# Altium schematic sheet Power.SchDoc: =Board +' X7A15T-PSU-LTTM4644'
size A3; Date: OCT 2018; CheckedBy: ALL; Author: Moerz; CompanyName: TDK-Micronas GmbH; DrawnBy: Moerz; Engineer: Moerz; Address1: Hans-Bunte-Strasse 19; Address2: D-79108 Freiburg; Address3: Germany; SheetNumber: 54; SheetTotal: 80; DateDraw: OCT 2018; DateChecked: N/A; PageSetup: Record=PageOptions|CenterHorizontal=True|CenterVertical=True|PrintScale=0.97|XCorrection=1.00|YCorrection=1.00|PrintKind=0|BorderSize=5000000|LeftOffset=0|BottomOffset=0|Orientation=2|PaperLength=1000|PaperWidth=1000|Scale=100|PaperSource=7|PrintQuality=-3|MediaType=1|DitherType=10|PrintScaleMode=1|PaperKind=A4|PaperIndex=9; TitleTyp: Title-Typ; Block: CPU & SCT8; Workspace: Workspace
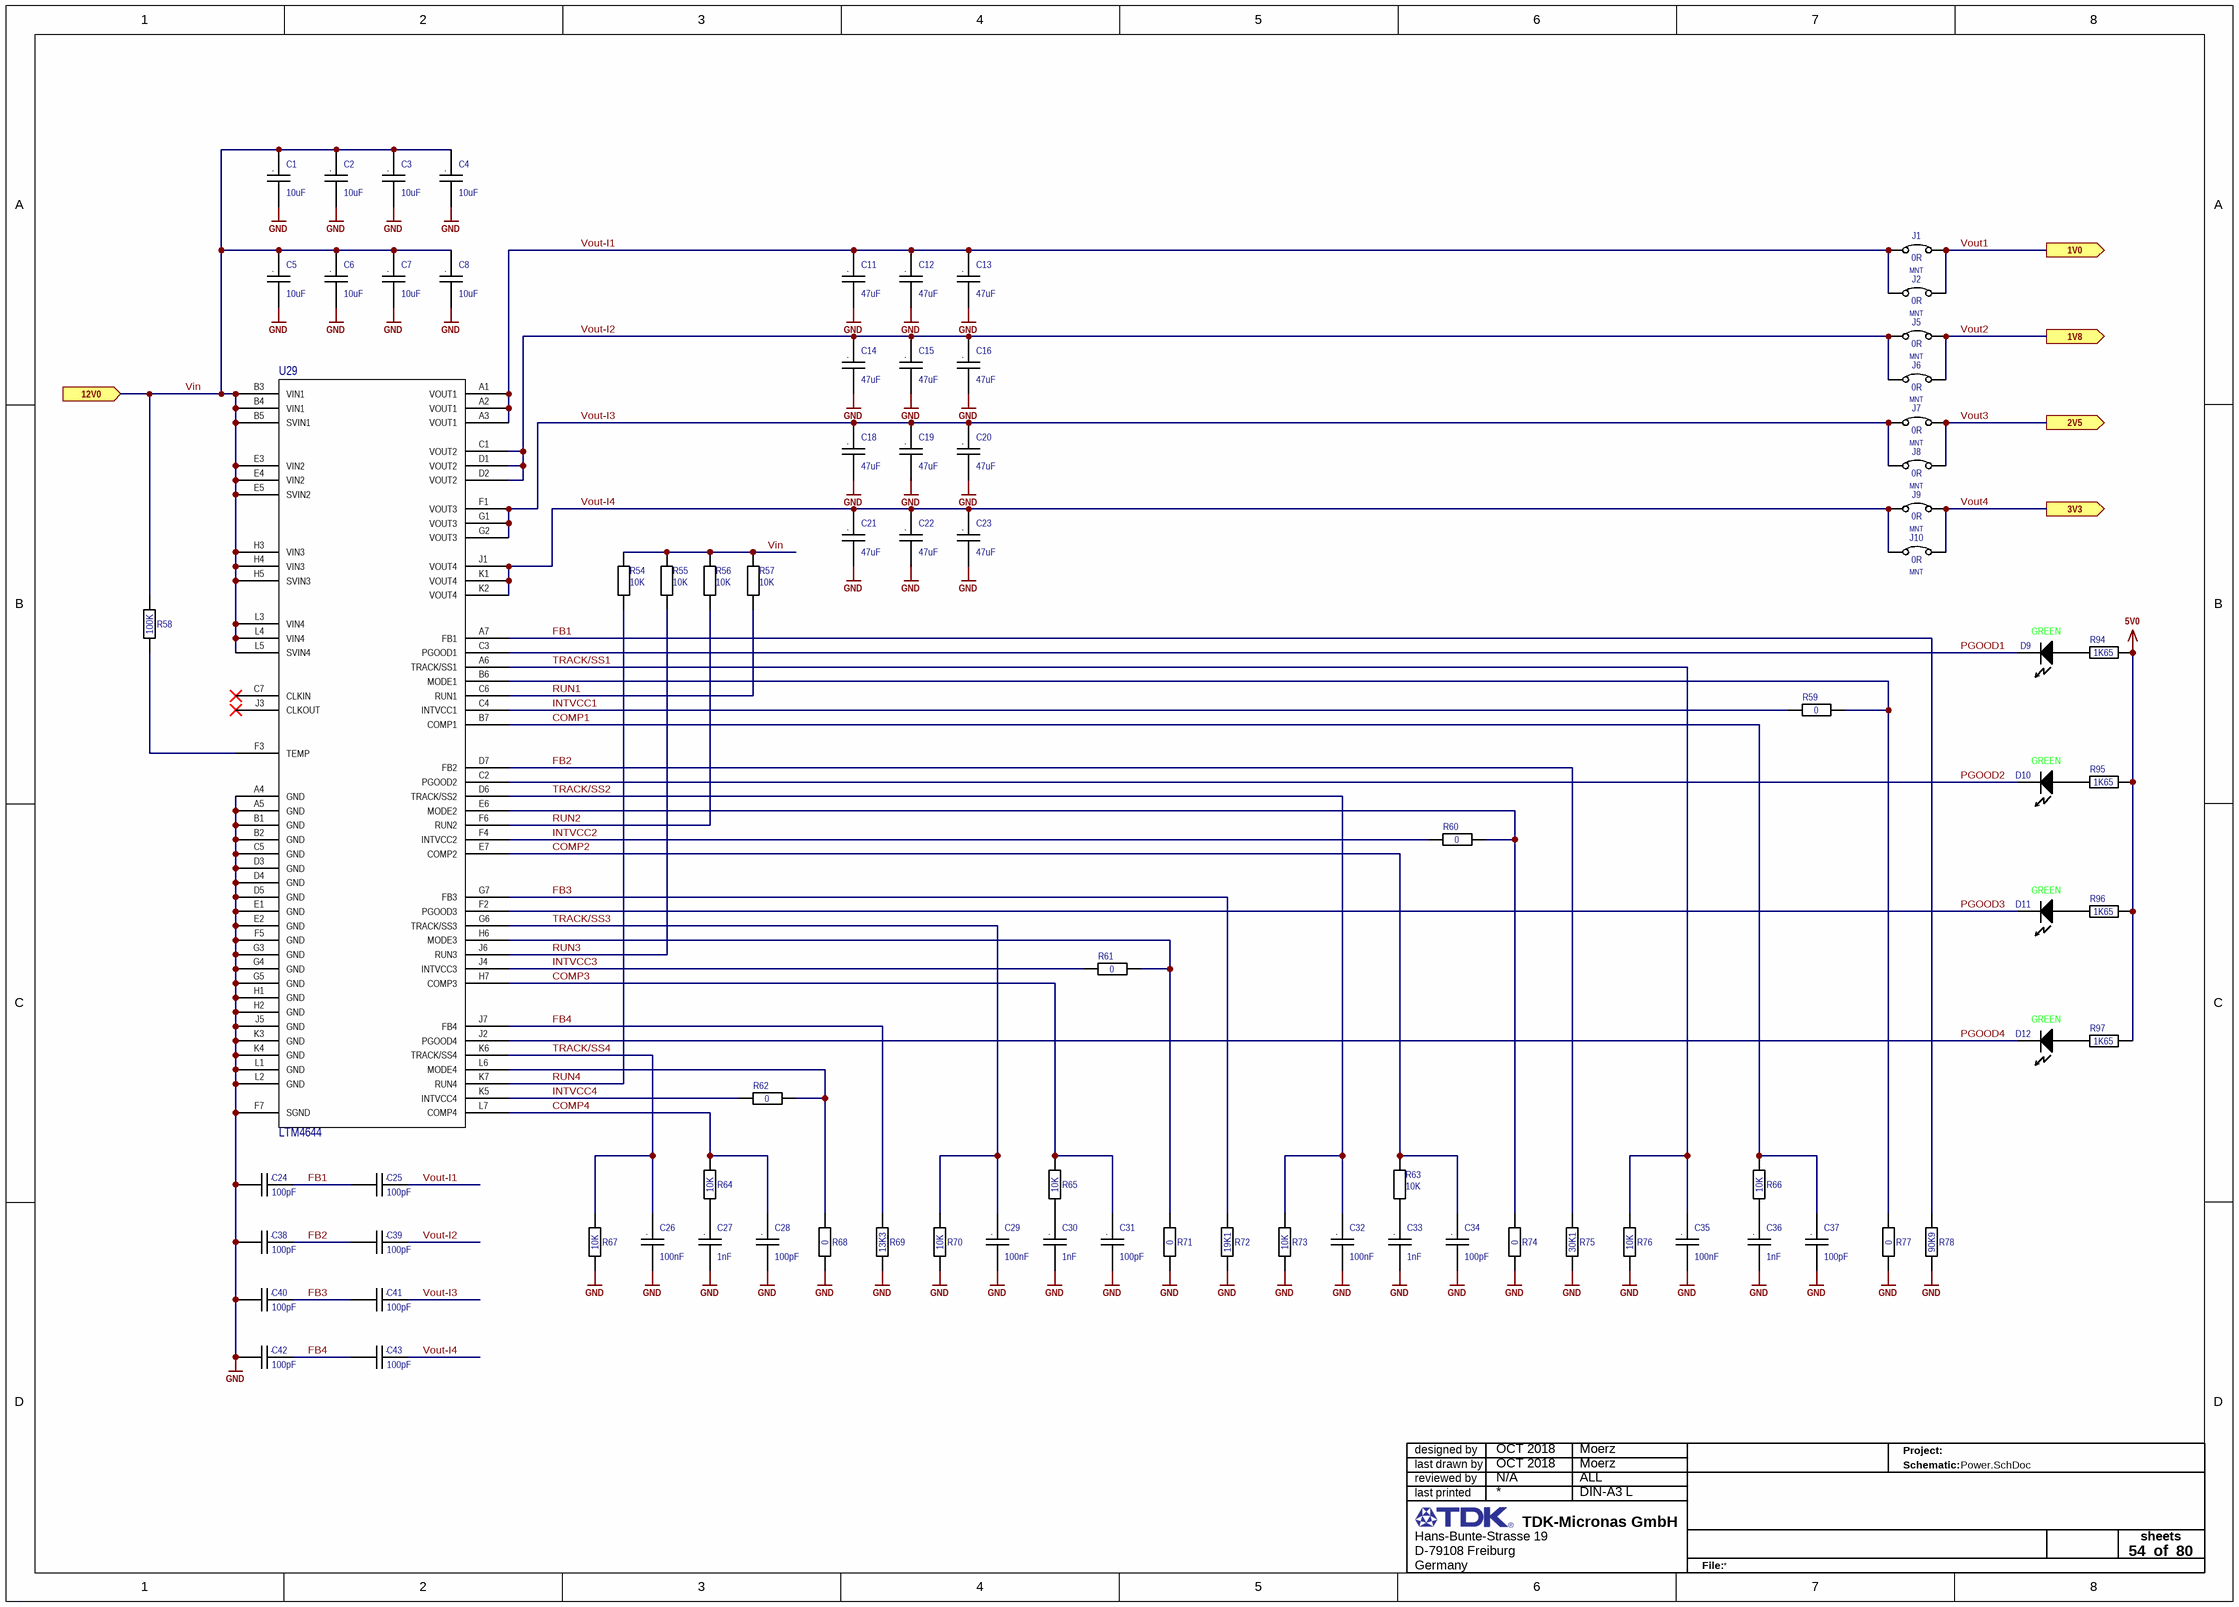
[diagram p0: Power.SchDoc]

## Parts
C1  value 10uF  [C1206 Reflow]  (hidden comment: C)
C2  value 10uF  [C1206 Reflow]  (hidden comment: C)
C3  value 10uF  [C1206 Reflow]  (hidden comment: C)
C4  value 10uF  [C1206 Reflow]  (hidden comment: C)
C5  value 10uF  [C1206 Reflow]  (hidden comment: C)
C6  value 10uF  [C1206 Reflow]  (hidden comment: C)
C7  value 10uF  [C1206 Reflow]  (hidden comment: C)
C8  value 10uF  [C1206 Reflow]  (hidden comment: C)
C11  value 47uF  [C1210 Reflow]  (hidden comment: C)
C12  value 47uF  [C1210 Reflow]  (hidden comment: C)
C13  value 47uF  [C1210 Reflow]  (hidden comment: C)
C14  value 47uF  [C1210 Reflow]  (hidden comment: C)
C15  value 47uF  [C1210 Reflow]  (hidden comment: C)
C16  value 47uF  [C1210 Reflow]  (hidden comment: C)
C18  value 47uF  [C1210 Reflow]  (hidden comment: C)
C19  value 47uF  [C1210 Reflow]  (hidden comment: C)
C20  value 47uF  [C1210 Reflow]  (hidden comment: C)
C21  value 47uF  [C1210 Reflow]  (hidden comment: C)
C22  value 47uF  [C1210 Reflow]  (hidden comment: C)
C23  value 47uF  [C1210 Reflow]  (hidden comment: C)
C24  value 100pF  [C0402 Reflow]  (hidden comment: C)
C25  value 100pF  [C0402 Reflow]  (hidden comment: C)
C26  value 100nF  [C0402 Reflow]  (hidden comment: C)
C27  value 1nF  [C0402 Reflow]  (hidden comment: C)
C28  value 100pF  [C0402 Reflow]  (hidden comment: C)
C29  value 100nF  [C0402 Reflow]  (hidden comment: C)
C30  value 1nF  [C0402 Reflow]  (hidden comment: C)
C31  value 100pF  [C0402 Reflow]  (hidden comment: C)
C32  value 100nF  [C0402 Reflow]  (hidden comment: C)
C33  value 1nF  [C0402 Reflow]  (hidden comment: C)
C34  value 100pF  [C0402 Reflow]  (hidden comment: C)
C35  value 100nF  [C0402 Reflow]  (hidden comment: C)
C36  value 1nF  [C0402 Reflow]  (hidden comment: C)
C37  value 100pF  [C0402 Reflow]  (hidden comment: C)
C38  value 100pF  [C0402 Reflow]  (hidden comment: C)
C39  value 100pF  [C0402 Reflow]  (hidden comment: C)
C40  value 100pF  [C0402 Reflow]  (hidden comment: C)
C41  value 100pF  [C0402 Reflow]  (hidden comment: C)
C42  value 100pF  [C0402 Reflow]  (hidden comment: C)
C43  value 100pF  [C0402 Reflow]  (hidden comment: C)
D9  Color: GREEN  [L0603G]  (hidden comment: D)
D10  Color: GREEN  [L0603G]  (hidden comment: D)
D11  Color: GREEN  [L0603G]  (hidden comment: D)
D12  Color: GREEN  [L0603G]  (hidden comment: D)
J1  value 0R  POPULATED: MNT  [JumperSMD]  (hidden comment: J)
J2  value 0R  POPULATED: MNT  [JumperSMD]  (hidden comment: J)
J5  value 0R  POPULATED: MNT  [JumperSMD]  (hidden comment: J)
J6  value 0R  POPULATED: MNT  [JumperSMD]  (hidden comment: J)
J7  value 0R  POPULATED: MNT  [JumperSMD]  (hidden comment: J)
J8  value 0R  POPULATED: MNT  [JumperSMD]  (hidden comment: J)
J9  value 0R  POPULATED: MNT  [JumperSMD]  (hidden comment: J)
J10  value 0R  POPULATED: MNT  [JumperSMD]  (hidden comment: J)
R54  value 10K  [R0402 Reflow]  (hidden comment: R)
R55  value 10K  [R0402 Reflow]  (hidden comment: R)
R56  value 10K  [R0402 Reflow]  (hidden comment: R)
R57  value 10K  [R0402 Reflow]  (hidden comment: R)
R58  value 100K  [R0402 Reflow]  (hidden comment: R)
R59  value 0  [R0402 Reflow]  (hidden comment: R)
R60  value 0  [R0402 Reflow]  (hidden comment: R)
R61  value 0  [R0402 Reflow]  (hidden comment: R)
R62  value 0  [R0402 Reflow]  (hidden comment: R)
R63  value 10K  [R0402 Reflow]  (hidden comment: R)
R64  value 10K  [R0402 Reflow]  (hidden comment: R)
R65  value 10K  [R0402 Reflow]  (hidden comment: R)
R66  value 10K  [R0402 Reflow]  (hidden comment: R)
R67  value 10K  [R0402 Reflow]  (hidden comment: R)
R68  value 0  [R0402 Reflow]  (hidden comment: R)
R69  value 13K3  [R0402 Reflow]  (hidden comment: R)
R70  value 10K  [R0402 Reflow]  (hidden comment: R)
R71  value 0  [R0402 Reflow]  (hidden comment: R)
R72  value 19K1  [R0402 Reflow]  (hidden comment: R)
R73  value 10K  [R0402 Reflow]  (hidden comment: R)
R74  value 0  [R0402 Reflow]  (hidden comment: R)
R75  value 30K1  [R0402 Reflow]  (hidden comment: R)
R76  value 10K  [R0402 Reflow]  (hidden comment: R)
R77  value 0  [R0402 Reflow]  (hidden comment: R)
R78  value 90K9  [R0402 Reflow]  (hidden comment: R)
R94  value 1K65  [R0402 Reflow]  (hidden comment: R)
R95  value 1K65  [R0402 Reflow]  (hidden comment: R)
R96  value 1K65  [R0402 Reflow]  (hidden comment: R)
R97  value 1K65  [R0402 Reflow]  (hidden comment: R)
U29  U  [LTM4644]  (value not drawn)

## Ports
1V0 (out), 1V8 (out), 2V5 (out), 3V3 (out), 12V0 (in)

## Nets
5V0: R94.2 R95.2 R96.2 R97.2
GND: C1.2 C2.2 C3.2 C4.2 C5.2 C6.2 C7.2 C8.2 C11.2 C12.2 C13.2 C14.2 C15.2 C16.2 C18.2 C19.2 C20.2 C21.2 C22.2 C23.2 C24.2 C26.2 C27.2 C28.2 C29.2 C30.2 C31.2 C32.2 C33.2 C34.2 C35.2 C36.2 C37.2 C38.2 C40.2 C42.2 R67.1 R68.1 R69.1 R70.1 R71.1 R72.1 R73.1 R74.1 R75.1 R76.1 R77.1 R78.1 U29.A4(GND) U29.A5(GND) U29.B1(GND) U29.B2(GND) U29.C5(GND) U29.D3(GND) U29.D4(GND) U29.D5(GND) U29.E1(GND) U29.E2(GND) U29.F5(GND) U29.F7(SGND) U29.G3(GND) U29.G4(GND) U29.G5(GND) U29.H1(GND) U29.H2(GND) U29.J5(GND) U29.K3(GND) U29.K4(GND) U29.L1(GND) U29.L2(GND)
COMP1: C37.1 R66.2 U29.B7(COMP1)
COMP2: C34.1 R63.2 U29.E7(COMP2)
COMP3: C31.1 R65.2 U29.H7(COMP3)
COMP4: C28.1 R64.2 U29.L7(COMP4)
FB1: C24.1 C25.2 R78.2 U29.A7(FB1)
FB2: C38.1 C39.2 R75.2 U29.D7(FB2)
FB3: C40.1 C41.2 R72.2 U29.G7(FB3)
FB4: C42.1 C43.2 R69.2 U29.J7(FB4)
INTVCC1: R59.2 U29.C4(INTVCC1)
INTVCC2: R60.2 U29.F4(INTVCC2)
INTVCC3: R61.2 U29.J4(INTVCC3)
INTVCC4: R62.2 U29.K5(INTVCC4)
PGOOD1: D9.2(Cathode) U29.C3(PGOOD1)
PGOOD2: D10.2(Cathode) U29.C2(PGOOD2)
PGOOD3: D11.2(Cathode) U29.F2(PGOOD3)
PGOOD4: D12.2(Cathode) U29.J2(PGOOD4)
RUN1: R57.1 U29.C6(RUN1)
RUN2: R56.1 U29.F6(RUN2)
RUN3: R55.1 U29.J6(RUN3)
RUN4: R54.1 U29.K7(RUN4)
TRACK/SS1: C35.1 R76.2 U29.A6(TRACK/SS1)
TRACK/SS2: C32.1 R73.2 U29.D6(TRACK/SS2)
TRACK/SS3: C29.1 R70.2 U29.G6(TRACK/SS3)
TRACK/SS4: C26.1 R67.2 U29.K6(TRACK/SS4)
Vin: C1.1 C2.1 C3.1 C4.1 C5.1 C6.1 C7.1 C8.1 R54.2 R55.2 R56.2 R57.2 R58.2 U29.B3(VIN1) U29.B4(VIN1) U29.B5(SVIN1) U29.E3(VIN2) U29.E4(VIN2) U29.E5(SVIN2) U29.H3(VIN3) U29.H4(VIN3) U29.H5(SVIN3) U29.L3(VIN4) U29.L4(VIN4) U29.L5(SVIN4) ; port 12V0
Vout1: J1.2 J2.2 ; port 1V0
Vout2: J5.2 J6.2 ; port 1V8
Vout3: J7.2 J8.2 ; port 2V5
Vout4: J9.2 J10.2 ; port 3V3
Vout-I1: C11.1 C12.1 C13.1 C25.1 J1.1 J2.1 U29.A1(VOUT1) U29.A2(VOUT1) U29.A3(VOUT1)
Vout-I2: C14.1 C15.1 C16.1 C39.1 J5.1 J6.1 U29.C1(VOUT2) U29.D1(VOUT2) U29.D2(VOUT2)
Vout-I3: C18.1 C19.1 C20.1 C41.1 J7.1 J8.1 U29.F1(VOUT3) U29.G1(VOUT3) U29.G2(VOUT3)
Vout-I4: C21.1 C22.1 C23.1 C43.1 J9.1 J10.1 U29.J1(VOUT4) U29.K1(VOUT4) U29.K2(VOUT4)
NetC27_1: C27.1 R64.1
NetC30_1: C30.1 R65.1
NetC33_1: C33.1 R63.1
NetC36_1: C36.1 R66.1
NetD9_1: D9.1(Anode) R94.1
NetD10_1: D10.1(Anode) R95.1
NetD11_1: D11.1(Anode) R96.1
NetD12_1: D12.1(Anode) R97.1
NetR58_1: R58.1 U29.F3(TEMP)
NetR59_1: R59.1 R77.2 U29.B6(MODE1)
NetR60_1: R60.1 R74.2 U29.E6(MODE2)
NetR61_1: R61.1 R71.2 U29.H6(MODE3)
NetR62_1: R62.1 R68.2 U29.L6(MODE4)

Not connected (* = marked no-connect by the designer): U29 C7(CLKIN)* J3(CLKOUT)*

## Notes on the sheet
- designed by
- reviewed by
- last drawn by
- Project:
- Schematic:
- last printed
- DIN-A3 L
- sheets
- of
- File:
- (in symbol C) .

## Library data of the parts
C1-C8 = C: CAP CER 10UF 25V X7R 1206; 04. Manufacturer: TDK Corporation; 07. Manufacturer  Part Number: C3216X7R1E106K160AB; Tolerance: ±10%; 03. Unit Price: 0.66; 13. Created Date/Name: AUG2018/Hören; Voltage Rating: 25V; Type: X7R; ComponentLink1Description: Info; ComponentLink1URL: https://www.digikey.de/products/en?keywords=445-7705-6-ND; 02. Distributor Part Number: 445-7705-6-ND; 09. Operating Temperature: -55°C ~ 125°C; 11. RoHS: YES; 01. Distributor: DigiKey; ComponentLink2Description: DataSheet; Package: 1206
C11-C16 C18-C23 = C: CAP CER 47UF 10V X5R 1210; 04. Manufacturer: Samsung Electro-Mechanics; 07. Manufacturer  Part Number: CL32A476MPJNNNE; Tolerance: ±20%; 03. Unit Price: 0.88; 13. Created Date/Name: AUG2018/Hören; Voltage Rating: 10V; Type: X5R; ComponentLink1Description: Info; ComponentLink1URL: *; 02. Distributor Part Number: 1276-3380-6-ND; 09. Operating Temperature: -55°C ~ 85°C; 11. RoHS: YES; 01. Distributor: DigiKey; ComponentLink2Description: DataSheet; Package: 1210
C24 C25 C28 C31 C34 C37-C43 = C: CAP CER 100PF 25V C0G/NP0 0402; 04. Manufacturer: KEMET; 07. Manufacturer  Part Number: C0402C101J3GACTU; Tolerance: ±5%; Type: C0G, NP0; 03. Unit Price: 0.09; 13. Created Date/Name: AUG2018/Hören; Voltage Rating: 25V; ComponentLink1Description: Info; ComponentLink1URL: https://www.digikey.de/products/en?keywords=399-1022-6-ND; 02. Distributor Part Number: 399-1022-6-ND; 09. Operating Temperature: -55°C ~ 125°C; 11. RoHS: YES; 01. Distributor: DigiKey; ComponentLink2Description: DataSheet; Package: 0402
C26 C29 C32 C35 = C: CAP CER 0.1UF 25V X7R 0402; 04. Manufacturer: Yageo; 07. Manufacturer  Part Number: CC0402KRX7R8BB104; Tolerance: ±10%; 03. Unit Price: 0.09; 13. Created Date/Name: AUG2018/Hören; Voltage Rating: 25V; Type: X7R; ComponentLink1Description: Info; ComponentLink1URL: https://www.digikey.de/products/en?keywords=311-2077-6-ND; 02. Distributor Part Number: 311-2077-6-ND; 09. Operating Temperature: -55°C ~ 125°C; 11. RoHS: YES; 01. Distributor: DigiKey; ComponentLink2Description: DataSheet; Package: 0402
C27 C30 C33 C36 = C: CAP CER 1000PF 25V X7R 0402; 04. Manufacturer: KEMET; 07. Manufacturer  Part Number: C0402C102K3RACTU; Tolerance: ±10%; 03. Unit Price: 0.09; 13. Created Date/Name: AUG2018/Hören; Voltage Rating: 25V; Type: X7R; ComponentLink1Description: Info; ComponentLink1URL: https://www.digikey.de/products/en?keywords=399-1031-6-ND; 02. Distributor Part Number: 399-1031-6-ND; 09. Operating Temperature: -55°C ~ 125°C; 11. RoHS: YES; 01. Distributor: DigiKey; ComponentLink2Description: DataSheet; Package: 0402
D9-D12 = LED: LED GREEN DIFFUSED 0603 SMD; 04. Manufacturer: OSRAM Opto Semiconductors Inc.; 07. Manufacturer  Part Number: LG L29K-G2J1-24-Z; Vf: 1.7V; If: 2mA; Wave Length: 570nm; Viewing Angle: 160°; 03. Unit Price: 0.4; 13. Created Date/Name: AUG2018/Hören; ComponentLink1Description: Info; ComponentLink1URL: https://www.digikey.de/products/en?keywords=475-2709-6-ND; ComponentLink2Description: DataSheet; ComponentLink2URL: https://www.digikey.de/products/en?keywords=475-2709-6-ND; 02. Distributor Part Number: 475-2709-6-ND; 11. RoHS: YES; 01. Distributor: DigiKey
J1 J2 J5-J10 = Jumper SMD: RES SMD 0 OHM JUMPER 1/10W 0603; 04. Manufacturer: Yageo; 07. Manufacturer  Part Number: RC0603JR-070RL; 03. Unit Price: 0.09; 01. Distributor: DigiKey; 02. Distributor Part Number: 311-0.0GRDKR-ND; 09. Operating Temperature: -55°C ~ 155°C; 11. RoHS: YES; Package: 0603; ComponentLink4Description: Info; ComponentLink4URL: https://www.digikey.de/product-detail/en/yageo/RC0603JR-070RL/311-0.0GRDKR-ND/732569; ComponentLink5Description: DataSheet; ComponentLink5URL: http://www.yageo.com/documents/recent/PYu-RC_Group_51_RoHS_L_10.pdf
R54-R57 R63-R67 R70 R73 R76 = R: RES SMD 10K OHM 1% 1/16W 0402; 04. Manufacturer: Yageo; 07. Manufacturer  Part Number: RC0402FR-0710KL; 03. Unit Price: 0.09; 13. Created Date/Name: AUG2018/Hören; Power Rating: 63mW; Tolerance: ±1%; ComponentLink1URL: https://www.digikey.de/products/en?keywords=311-10.0KLRDKR-ND; ComponentLink1Description: Info; 02. Distributor Part Number: 311-10.0KLRDKR-ND; 09. Operating Temperature: -55°C ~ 155°C; 11. RoHS: YES; 01. Distributor: DigiKey; ComponentLink2Description: DataSheet; Type: Thick Film; Package: 0402
R58 = R: RES SMD 100K OHM 1% 1/16W 0402; 04. Manufacturer: Yageo; 07. Manufacturer  Part Number: RC0402FR-07100KL; 03. Unit Price: 0.09; 13. Created Date/Name: AUG2018/Hören; Power Rating: 63mW; Tolerance: ±1%; ComponentLink1URL: *; ComponentLink1Description: Info; 02. Distributor Part Number: 311-100KLRDKR-ND; 09. Operating Temperature: -55°C ~ 155°C; 11. RoHS: YES; 01. Distributor: DigiKey; ComponentLink2Description: DataSheet; Type: Thick Film; Package: 0402
R59-R62 R68 R71 R74 R77 = R: RES SMD 0 OHM JUMPER 1/16W 0402; 04. Manufacturer: Yageo; 07. Manufacturer  Part Number: RC0402JR-070RL; 03. Unit Price: 0.09; 13. Created Date/Name: AUG2018/Hören; Power Rating: 63mW; ComponentLink1URL: https://www.digikey.de/products/en?keywords=311-0.0JRDKR-ND; ComponentLink1Description: Info; 02. Distributor Part Number: 311-0.0JRDKR-ND; 09. Operating Temperature: -55°C ~ 155°C; 11. RoHS: YES; 01. Distributor: DigiKey; ComponentLink2Description: DataSheet; Type: Thick Film; Package: 0402
R69 = R: RES SMD 13.3K OHM 1% 1/16W 0402; 04. Manufacturer: Yageo; 07. Manufacturer  Part Number: RC0402FR-0713K3L; 03. Unit Price: 0.09; 13. Created Date/Name: AUG2018/Hören; Power Rating: 63mW; Tolerance: ±1%; ComponentLink1URL: https://www.digikey.de/products/en?keywords=YAG2974DKR-ND; ComponentLink1Description: Info; 02. Distributor Part Number: YAG2974DKR-ND; 09. Operating Temperature: -55°C ~ 155°C; 11. RoHS: YES; 01. Distributor: DigiKey; ComponentLink2Description: DataSheet; Type: Thick Film; Package: 0402
R72 = R: RES SMD 19.1K OHM 1% 1/16W 0402; 04. Manufacturer: Yageo; 07. Manufacturer  Part Number: RC0402FR-0719K1L; 03. Unit Price: 0.09; 13. Created Date/Name: AUG2018/Hören; Power Rating: 63mW; Tolerance: ±1%; ComponentLink1URL: *; ComponentLink1Description: Info; 02. Distributor Part Number: 311-19.1KLRDKR-ND; 09. Operating Temperature: -55°C ~ 155°C; 11. RoHS: YES; 01. Distributor: DigiKey; ComponentLink2Description: DataSheet; Type: Thick Film; Package: 0402
R75 = R: RES SMD 30.1K OHM 1% 1/16W 0402; 04. Manufacturer: Yageo; 07. Manufacturer  Part Number: RC0402FR-0730K1L; 03. Unit Price: 0.09; 13. Created Date/Name: AUG2018/Hören; Power Rating: 63mW; Tolerance: ±1%; ComponentLink1URL: https://www.digikey.de/products/en?keywords=311-30.1KLRDKR-ND; ComponentLink1Description: Info; 02. Distributor Part Number: 311-30.1KLRDKR-ND; 09. Operating Temperature: -55°C ~ 155°C; 11. RoHS: YES; 01. Distributor: DigiKey; ComponentLink2Description: DataSheet; Type: Thick Film; Package: 0402
R78 = R: RES SMD 90.9K OHM 1% 1/16W 0402; 04. Manufacturer: Yageo; 07. Manufacturer  Part Number: RC0402FR-0790K9L; 03. Unit Price: 0.09; 13. Created Date/Name: AUG2018/Hören; Power Rating: 63mW; Tolerance: ±1%; ComponentLink1URL: *; ComponentLink1Description: Info; 02. Distributor Part Number: 311-90.9KLRDKR-ND; 09. Operating Temperature: -55°C ~ 155°C; 11. RoHS: YES; 01. Distributor: DigiKey; ComponentLink2Description: DataSheet; Type: Thick Film; Package: 0402
R94-R97 = R: RES SMD 1.65K OHM 1% 1/16W 0402; 04. Manufacturer: Yageo; 07. Manufacturer  Part Number: RC0402FR-071K65L; 03. Unit Price: 0.09; 13. Created Date/Name: AUG2018/Hören; Power Rating: 63mW; Tolerance: ±1%; ComponentLink1URL: https://www.digikey.de/product-detail/en/yageo/RC0402FR-071K65L/YAG3043DKR-ND/5282914; ComponentLink1Description: Info; 02. Distributor Part Number: YAG3043DKR-ND; 09. Operating Temperature: -55°C ~ 155°C; 11. RoHS: YES; 01. Distributor: DigiKey; ComponentLink2Description: DataSheet; Type: Thick Film; Package: 0402
U29 = LTM4644: DC DC CONVERTER 4X0.6-5.5V; MFR-PN: LTM4644EY#PBF; MFR: LINEAR TECHNOLOGY; 04. Manufacturer: Linear Technology/Analog Devices; POPULATED: yes; 03. Unit Price: 39.30; 01. Distributor: DigiKey; 02. Distributor Part Number: LTM4644EY#PBF-ND; 07. Manufacturer  Part Number: LTM4644EY#PBF; 09. Operating Temperature: -40°C ~ 125°C; 11. RoHS: YES; ComponentLink4Description: Info; ComponentLink4URL: https://www.digikey.de/products/en?keywords=LTM4644EY%23PBF; ComponentLink5Description: DataSheet; ComponentLink5URL: http://www.analog.com/media/en/technical-documentation/data-sheets/4644fe.pdf; NicName: LTM4644